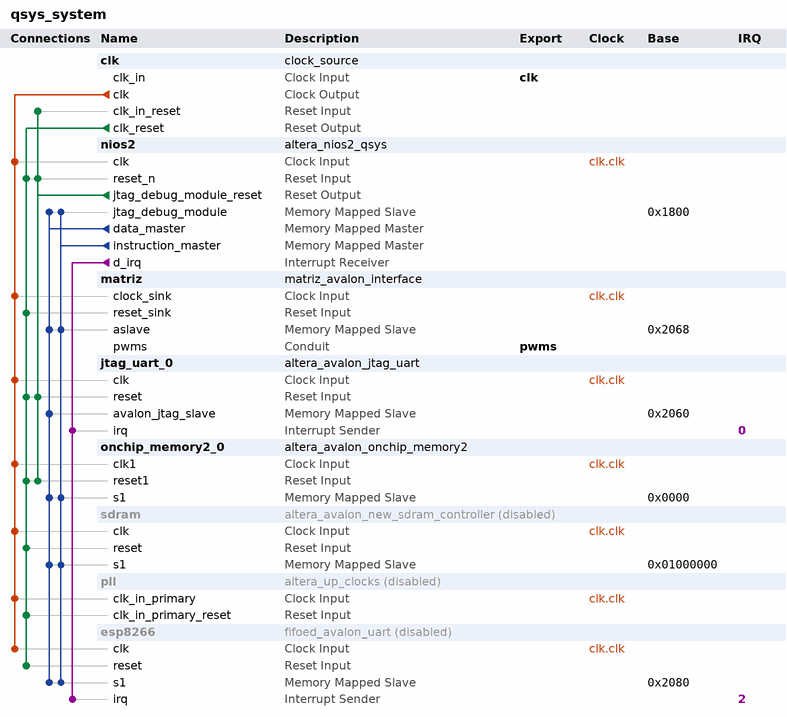
[diagram p0: system contents]
# Platform Designer (Qsys) system qsys_system, Cyclone II EP2C35F672C6
# Parameters at their usual value, and those the tool derives, are not listed.
package require -exact qsys 13.0
create_system qsys_system
set_project_property DEVICE_FAMILY {Cyclone II}
set_project_property DEVICE EP2C35F672C6

add_instance clk clock_source 13.0
set_instance_parameter_value clk clockFrequency 50000000

add_instance nios2 altera_nios2_qsys 13.0
set_instance_parameter_value nios2 resetSlave onchip_memory2_0.s1
set_instance_parameter_value nios2 mmu_TLBMissExcSlave None
set_instance_parameter_value nios2 exceptionSlave onchip_memory2_0.s1
set_instance_parameter_value nios2 breakSlave nios2.jtag_debug_module
set_instance_parameter_value nios2 impl Tiny
set_instance_parameter_value nios2 icache_size 4096

add_instance matriz matriz_avalon_interface 1.0
set_instance_parameter_value matriz rows 4
set_instance_parameter_value matriz cols 4
set_instance_parameter_value matriz data_width 32

add_instance jtag_uart_0 altera_avalon_jtag_uart 13.0.1.99.2
set_instance_parameter_value jtag_uart_0 simInteractiveOptions NO_INTERACTIVE_WINDOWS

add_instance onchip_memory2_0 altera_avalon_onchip_memory2 13.0.1.99.2
set_instance_parameter_value onchip_memory2_0 dataWidth 32
set_instance_parameter_value onchip_memory2_0 dualPort false
set_instance_parameter_value onchip_memory2_0 initMemContent true
set_instance_parameter_value onchip_memory2_0 initializationFileName onchip_mem.hex
set_instance_parameter_value onchip_memory2_0 memorySize 4096

add_instance sdram altera_avalon_new_sdram_controller 13.0.1.99.2
set_instance_property sdram ENABLED false
set_instance_parameter_value sdram TAC 5.5
set_instance_parameter_value sdram TRCD 20.0
set_instance_parameter_value sdram TRP 20.0
set_instance_parameter_value sdram casLatency 3
set_instance_parameter_value sdram columnWidth 8
set_instance_parameter_value sdram dataWidth 16
set_instance_parameter_value sdram generateSimulationModel false
set_instance_parameter_value sdram model single_Micron_MT48LC4M32B2_7_chip
set_instance_parameter_value sdram numberOfBanks 4
set_instance_parameter_value sdram numberOfChipSelects 1
set_instance_parameter_value sdram powerUpDelay 100.0
set_instance_parameter_value sdram refreshPeriod 15.625
set_instance_parameter_value sdram rowWidth 12

add_instance pll altera_up_clocks 13.0
set_instance_property pll ENABLED false
set_instance_parameter_value pll board DE2
set_instance_parameter_value pll vga_clk false
set_instance_parameter_value pll audio_clk false
set_instance_parameter_value pll audio_clk_freq 12.288

add_instance esp8266 fifoed_avalon_uart 13.2
set_instance_property esp8266 ENABLED false
set_instance_parameter_value esp8266 baud 115200
set_instance_parameter_value esp8266 dataBits 8
set_instance_parameter_value esp8266 fixedBaud true
set_instance_parameter_value esp8266 parity NONE
set_instance_parameter_value esp8266 simInteractiveInputEnable false
set_instance_parameter_value esp8266 simInteractiveOutputEnable false
set_instance_parameter_value esp8266 simTrueBaud false
set_instance_parameter_value esp8266 stopBits 1
set_instance_parameter_value esp8266 syncRegDepth 2
set_instance_parameter_value esp8266 useCtsRts false
set_instance_parameter_value esp8266 useEopRegister false
set_instance_parameter_value esp8266 useRelativePathForSimFile false
set_instance_parameter_value esp8266 use_status_bit_clear false
set_instance_parameter_value esp8266 use_tx_fifo true
set_instance_parameter_value esp8266 fifo_size_tx 1024
set_instance_parameter_value esp8266 tx_fifo_LE false
set_instance_parameter_value esp8266 tx_IRQ_Threshold 1
set_instance_parameter_value esp8266 use_rx_fifo true
set_instance_parameter_value esp8266 fifo_size_rx 1024
set_instance_parameter_value esp8266 rx_fifo_LE false
set_instance_parameter_value esp8266 rx_IRQ_Threshold 1
set_instance_parameter_value esp8266 fifo_export_used false
set_instance_parameter_value esp8266 hw_cts false
set_instance_parameter_value esp8266 trans_pin false
set_instance_parameter_value esp8266 use_timout false
set_instance_parameter_value esp8266 timeout_value 4
set_instance_parameter_value esp8266 use_gap_detection false
set_instance_parameter_value esp8266 gap_value 4
set_instance_parameter_value esp8266 use_timestamp false
set_instance_parameter_value esp8266 use_ext_timestamp false
set_instance_parameter_value esp8266 timestamp_width 8
set_instance_parameter_value esp8266 export_handshake false
set_instance_parameter_value esp8266 add_error_bits false
set_instance_parameter_value esp8266 driver_pass_error_bits false

# connections
add_connection clk.clk esp8266.clk clock
add_connection clk.clk jtag_uart_0.clk clock
add_connection clk.clk matriz.clock_sink clock
add_connection clk.clk nios2.clk clock
add_connection clk.clk onchip_memory2_0.clk1 clock
add_connection clk.clk pll.clk_in_primary clock
add_connection clk.clk sdram.clk clock
add_connection clk.clk_reset esp8266.reset reset
add_connection clk.clk_reset jtag_uart_0.reset reset
add_connection clk.clk_reset matriz.reset_sink reset
add_connection clk.clk_reset nios2.reset_n reset
add_connection clk.clk_reset onchip_memory2_0.reset1 reset
add_connection clk.clk_reset pll.clk_in_primary_reset reset
add_connection clk.clk_reset sdram.reset reset
add_connection nios2.jtag_debug_module_reset clk.clk_in_reset reset
add_connection nios2.jtag_debug_module_reset jtag_uart_0.reset reset
add_connection nios2.jtag_debug_module_reset nios2.reset_n reset
add_connection nios2.jtag_debug_module_reset onchip_memory2_0.reset1 reset
add_connection nios2.data_master esp8266.s1 avalon
set_connection_parameter_value nios2.data_master/esp8266.s1 baseAddress 0x2080
add_connection nios2.data_master jtag_uart_0.avalon_jtag_slave avalon
set_connection_parameter_value nios2.data_master/jtag_uart_0.avalon_jtag_slave baseAddress 0x2060
add_connection nios2.data_master matriz.aslave avalon
set_connection_parameter_value nios2.data_master/matriz.aslave baseAddress 0x2068
add_connection nios2.data_master nios2.jtag_debug_module avalon
set_connection_parameter_value nios2.data_master/nios2.jtag_debug_module baseAddress 0x1800
add_connection nios2.data_master onchip_memory2_0.s1 avalon
set_connection_parameter_value nios2.data_master/onchip_memory2_0.s1 baseAddress 0x0000
add_connection nios2.data_master sdram.s1 avalon
set_connection_parameter_value nios2.data_master/sdram.s1 baseAddress 0x01000000
add_connection nios2.instruction_master esp8266.s1 avalon
set_connection_parameter_value nios2.instruction_master/esp8266.s1 baseAddress 0x2080
add_connection nios2.instruction_master matriz.aslave avalon
set_connection_parameter_value nios2.instruction_master/matriz.aslave baseAddress 0x2068
add_connection nios2.instruction_master nios2.jtag_debug_module avalon
set_connection_parameter_value nios2.instruction_master/nios2.jtag_debug_module baseAddress 0x1800
add_connection nios2.instruction_master onchip_memory2_0.s1 avalon
set_connection_parameter_value nios2.instruction_master/onchip_memory2_0.s1 baseAddress 0x0000
add_connection nios2.instruction_master sdram.s1 avalon
set_connection_parameter_value nios2.instruction_master/sdram.s1 baseAddress 0x01000000
add_connection nios2.d_irq esp8266.irq interrupt
set_connection_parameter_value nios2.d_irq/esp8266.irq irqNumber 2
add_connection nios2.d_irq jtag_uart_0.irq interrupt
set_connection_parameter_value nios2.d_irq/jtag_uart_0.irq irqNumber 0

# exported interfaces
add_interface clk clock sink
set_interface_property clk EXPORT_OF clk.clk_in
add_interface pwms conduit end
set_interface_property pwms EXPORT_OF matriz.pwms

set_interconnect_requirement {$system} qsys_mm.clockCrossingAdapter HANDSHAKE
set_interconnect_requirement {$system} qsys_mm.maxAdditionalLatency 1

save_system qsys_system.qsys
